# EAGLE design Drehzahlanzeige_RevB (EAGLE 7.6.0)

## Sheet 1 of 2
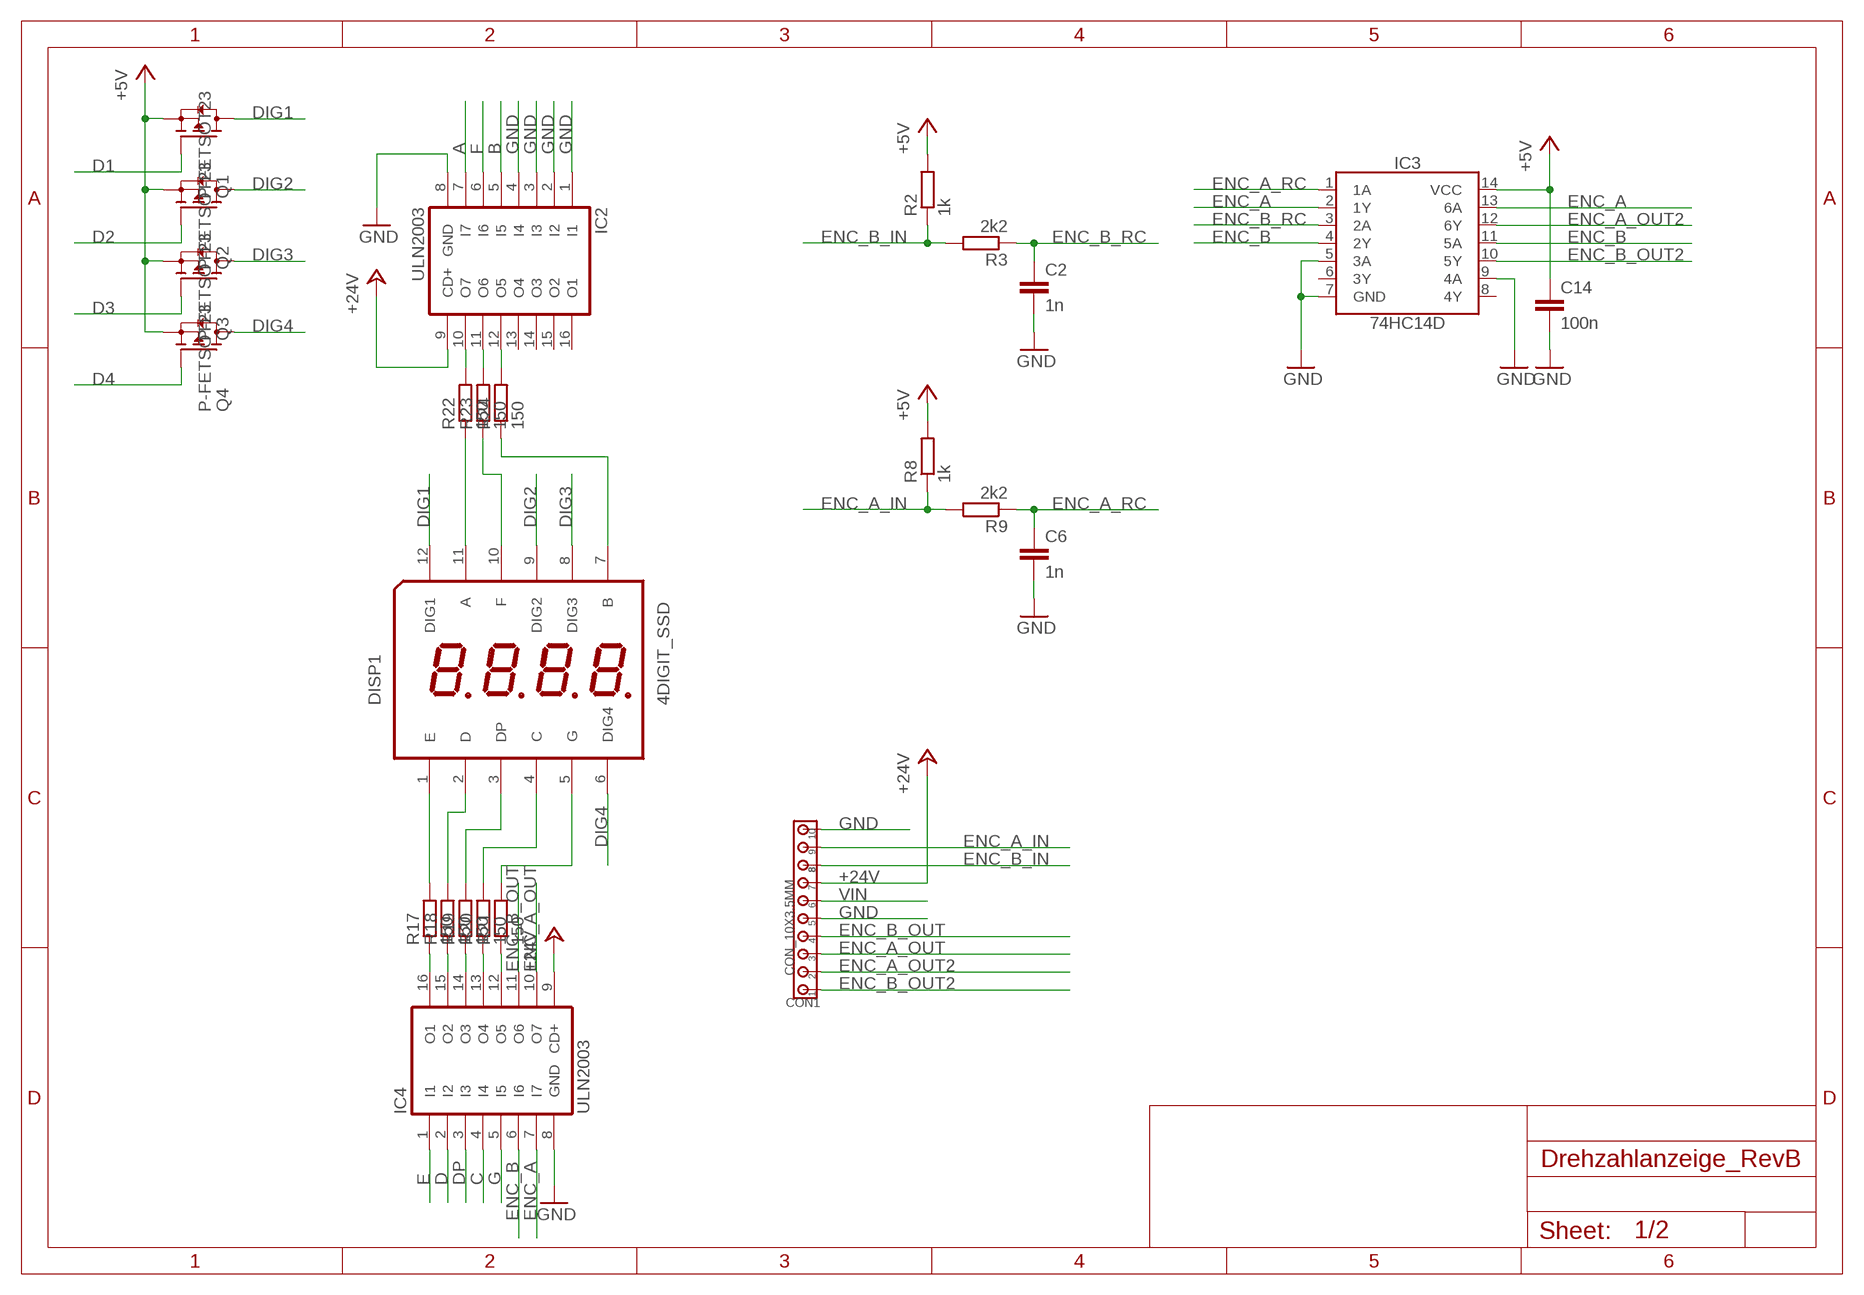
[diagram p0: schematic, sheet 1]

### Parts
C2  1n  CC0805  [C0805]
C6  1n  CC0805  [C0805]
C14  100n  CC0805  [C0805]
CON1  CON_10X3.5MM  [3.5MM_10X]
DISP1  4DIGIT_SSD  [4DIGIT_SSD]
IC2  ULN2003  [SO16]
IC3  74HC14D  [SO14]
IC4  ULN2003  [SO16]
Q1  P-FETSOT23  [SOT23]
Q2  P-FETSOT23  [SOT23]
Q3  P-FETSOT23  [SOT23]
Q4  P-FETSOT23  [SOT23]
R2  1k  RESISTORR0805  [R0805]
R3  2k2  RESISTORR0805  [R0805]
R8  1k  RESISTORR0805  [R0805]
R9  2k2  RESISTORR0805  [R0805]
R17  150  RESISTORR0805  [R0805]
R18  150  RESISTORR0805  [R0805]
R19  150  RESISTORR0805  [R0805]
R20  150  RESISTORR0805  [R0805]
R21  150  RESISTORR0805  [R0805]
R22  150  RESISTORR0805  [R0805]
R23  150  RESISTORR0805  [R0805]
R24  150  RESISTORR0805  [R0805]

### Nets
+5V [+5v]: C14.1 IC3.14(VCC) Q1.2(S) Q2.2(S) Q3.2(S) Q4.2(S) R2.2 R8.2 ; also sheet 2
+24V [+5v]: CON1.7 IC2.9(CD+) IC4.9(CD+) ; also sheet 2
A: IC2.7(I7) ; also sheet 2
B: IC2.5(I5) ; also sheet 2
C: IC4.4(I4) ; also sheet 2
D: IC4.2(I2) ; also sheet 2
D1: Q1.1(G) ; also sheet 2
D2: Q2.1(G) ; also sheet 2
D3: Q3.1(G) ; also sheet 2
D4: Q4.1(G) ; also sheet 2
DIG1: DISP1.12(DIG1) Q1.3(D)
DIG2: DISP1.9(DIG2) Q2.3(D)
DIG3: DISP1.8(DIG3) Q3.3(D)
DIG4: DISP1.6(DIG4) Q4.3(D)
DP: IC4.3(I3) ; also sheet 2
E: IC4.1(I1) ; also sheet 2
ENC_A: IC3.2(1Y) IC3.13(6A) IC4.7(I7) ; also sheet 2
ENC_A_IN: CON1.9 R8.1 R9.2
ENC_A_OUT: CON1.3 IC4.10(O7)
ENC_A_OUT2: CON1.2 IC3.12(6Y)
ENC_A_RC: C6.1 IC3.1(1A) R9.1
ENC_B: IC3.4(2Y) IC3.11(5A) IC4.6(I6) ; also sheet 2
ENC_B_IN: CON1.8 R2.1 R3.2
ENC_B_OUT: CON1.4 IC4.11(O6)
ENC_B_OUT2: CON1.1 IC3.10(5Y)
ENC_B_RC: C2.1 IC3.3(2A) R3.1
F: IC2.6(I6) ; also sheet 2
G: IC4.5(I5) ; also sheet 2
GND: C2.2 C6.2 C14.2 CON1.5 CON1.10 IC2.1(I1) IC2.2(I2) IC2.3(I3) IC2.4(I4) IC2.8(GND) IC3.5(3A) IC3.7(GND) IC3.9(4A) IC4.8(GND) ; also sheet 2
N$5: DISP1.1(E) R17.2
N$6: DISP1.2(D) R18.2
N$10: DISP1.3(DP) R19.2
N$11: DISP1.4(C) R20.2
N$12: DISP1.5(G) R21.2
N$13: DISP1.11(A) R22.1
N$14: DISP1.10(F) R23.1
N$15: DISP1.7(B) R24.1
N$16: IC4.16(O1) R17.1
N$17: IC4.15(O2) R18.1
N$18: IC4.14(O3) R19.1
N$19: IC4.13(O4) R20.1
N$20: IC4.12(O5) R21.1
N$21: IC2.10(O7) R22.2
N$22: IC2.11(O6) R23.2
N$23: IC2.12(O5) R24.2
VIN: CON1.6 ; also sheet 2
Unconnected: IC2.13(O4) IC2.14(O3) IC2.15(O2) IC2.16(O1) IC3.6(3Y) IC3.8(4Y)

## Sheet 2 of 2
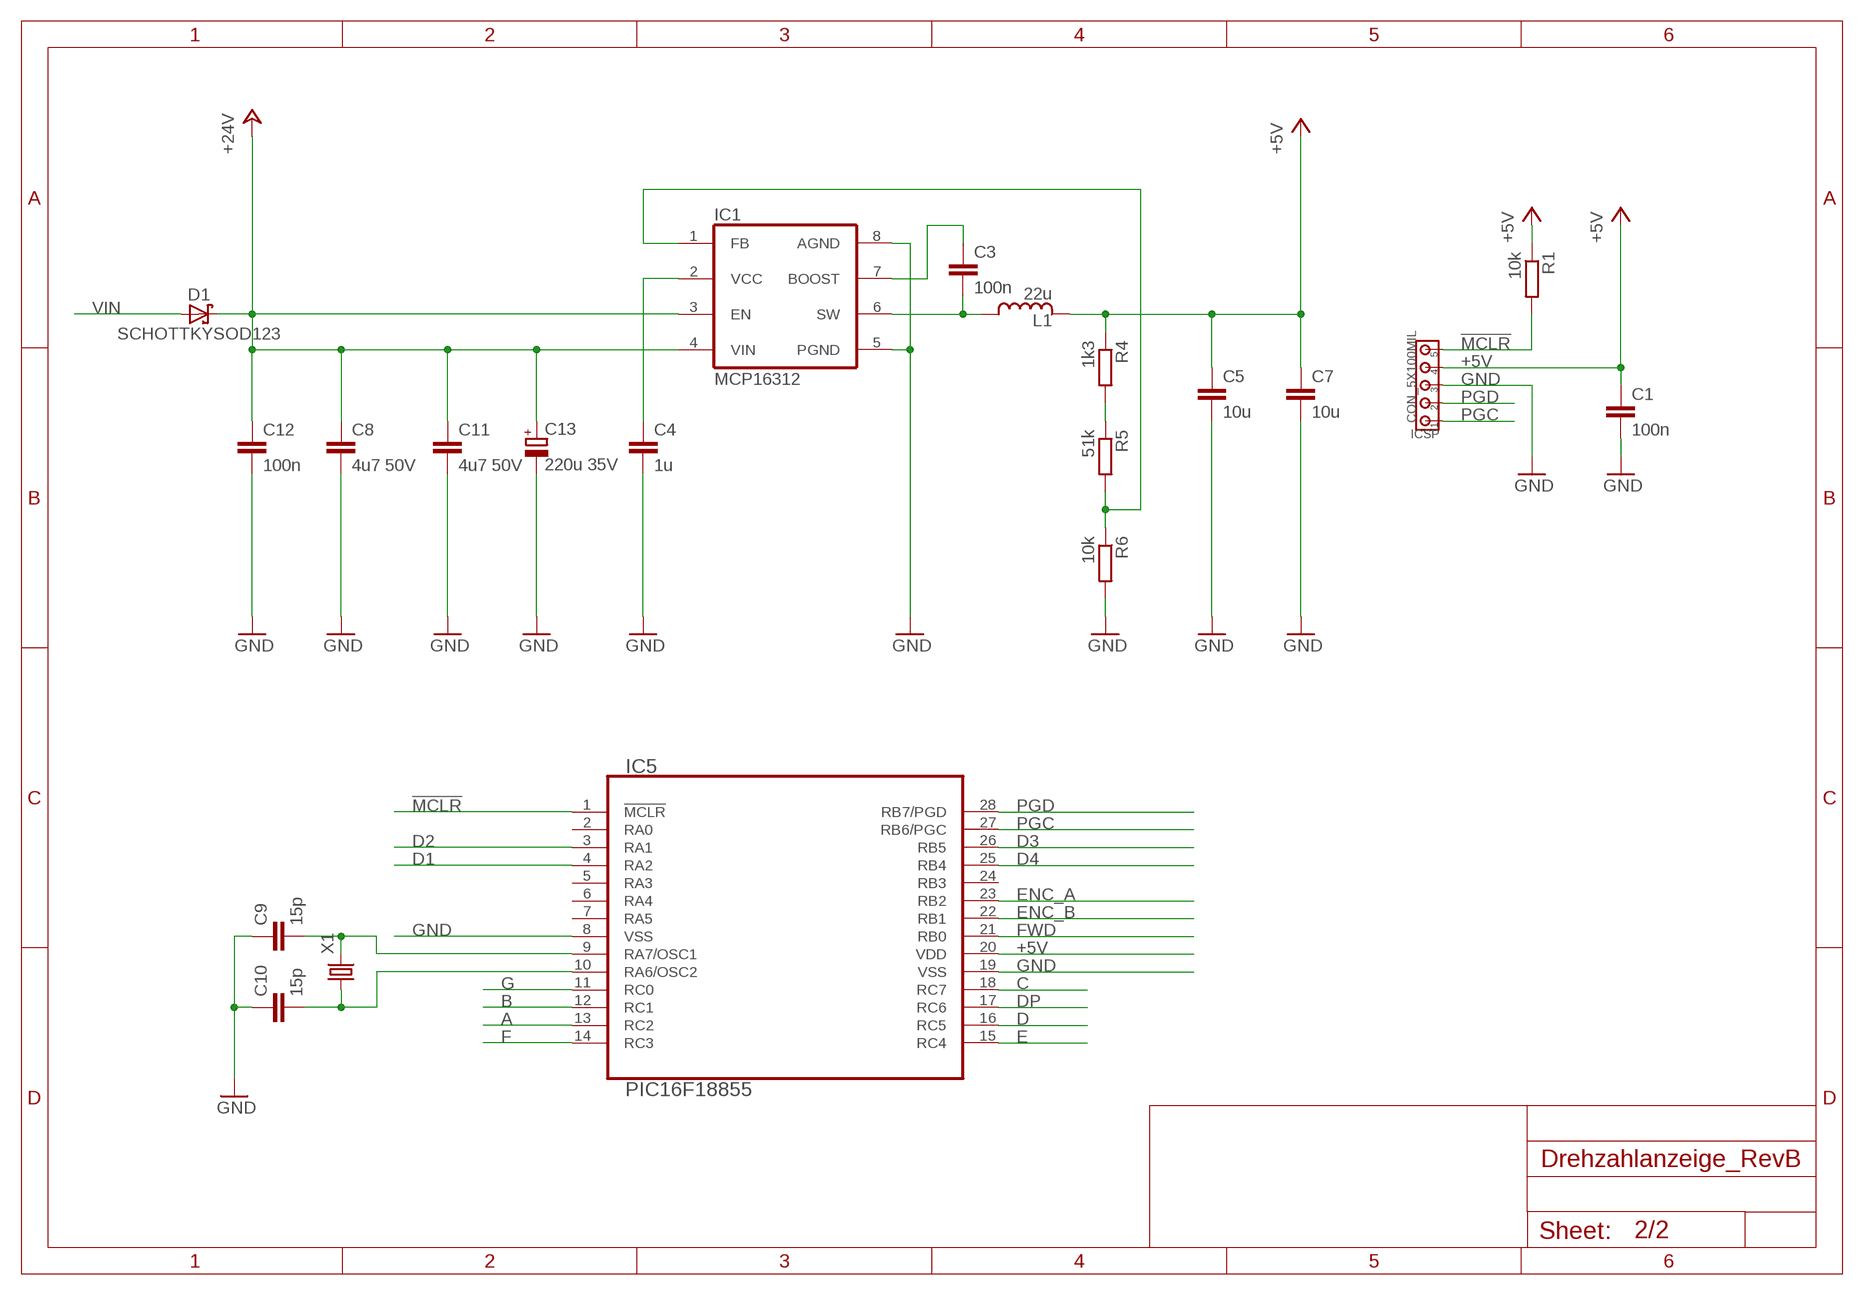
[diagram p1: schematic, sheet 2]

### Parts
C1  100n  CC0805  [C0805]
C3  100n  CC0805  [C0805]
C4  1u  CC0805  [C0805]
C5  10u  CC0805  [C0805]
C7  10u  CC0805  [C0805]
C8  4u7 50V  CC1206  [C1206]
C9  15p  CC0805  [C0805]
C10  15p  CC0805  [C0805]
C11  4u7 50V  CC1206  [C1206]
C12  100n  CC0805  [C0805]
C13  220u 35V  C_POLARIZED8MM  [8MM]
D1  SCHOTTKYSOD123  [SOD123]
IC1  MCP16312  MCP16311  [MSOP8]
IC5  PIC16F18855  [SO28W]
ICSP  CON_5X100MIL  [100MIL_5X]
L1  22u  INDUCTORLPS4018  [LPS4018]
R1  10k  RESISTORR0805  [R0805]
R4  1k3  RESISTORR0805  [R0805]
R5  51k  RESISTORR0805  [R0805]
R6  10k  RESISTORR0805  [R0805]
X1  CRYSTAL5X3.2MM  [5X3.2MM]

### Nets
!MCLR!: IC5.1(!MCLR!) ICSP.5 R1.2
+5V [+5v]: C1.1 C5.1 C7.1 IC5.20(VDD) ICSP.4 L1.2 R1.1 R4.1 ; also sheet 1
+24V [+5v]: C8.1 C11.1 C12.1 C13.+ D1.C IC1.3(EN) IC1.4(VIN) ; also sheet 1
A: IC5.13(RC2) ; also sheet 1
B: IC5.12(RC1) ; also sheet 1
BOOST: C3.1 IC1.7(BOOST)
C: IC5.18(RC7) ; also sheet 1
D: IC5.16(RC5) ; also sheet 1
D1: IC5.4(RA2) ; also sheet 1
D2: IC5.3(RA1) ; also sheet 1
D3: IC5.26(RB5) ; also sheet 1
D4: IC5.25(RB4) ; also sheet 1
DP: IC5.17(RC6) ; also sheet 1
E: IC5.15(RC4) ; also sheet 1
ENC_A: IC5.23(RB2) ; also sheet 1
ENC_B: IC5.22(RB1) ; also sheet 1
F: IC5.14(RC3) ; also sheet 1
FWD: IC5.21(RB0)
G: IC5.11(RC0) ; also sheet 1
GND: C1.2 C4.2 C5.2 C7.2 C8.2 C9.1 C10.1 C11.2 C12.2 C13.- IC1.5(PGND) IC1.8(AGND) IC5.8(VSS) IC5.19(VSS) ICSP.3 R6.2 ; also sheet 1
N$3: IC1.1(FB) R5.2 R6.1
N$4: R4.2 R5.1
N$8: C4.1 IC1.2(VCC)
N$32: C10.2 IC5.10(RA6/OSC2) X1.1
N$33: C9.2 IC5.9(RA7/OSC1) X1.2
PGC: IC5.27(RB6/PGC) ICSP.1
PGD: IC5.28(RB7/PGD) ICSP.2
SWITCH: C3.2 IC1.6(SW) L1.1
VIN: D1.A ; also sheet 1
Unconnected: IC5.2(RA0) IC5.5(RA3) IC5.7(RA5) IC5.24(RB3)

## Power pins joined to a net without a drawn wire
RA4: IC5.6(RA4)

## Library data of the parts
C1-C12 C14 = 00Capacitor:C: Capacitor
C13 = 00Capacitor:C_POLARIZED
CON1 = 00Connector:CON_10X: 10-pin header
D1 = 00Diode:SCHOTTKY
DISP1 = 00Display:4DIGIT_SSD: 4 digit 7-segment display
IC1 = 00VoltageRegulator:MCP16311
IC2 IC4 = 00Transistor:ULN2003: Seven Darlington array
IC3 = 00Logic:74HC14: Hex Inverter Schmitt Trigger
IC5 = 00PIC:PIC16F18855
ICSP = 00Connector:CON_5X: 5-pin header
L1 = 00Inductor:INDUCTOR
Q1-Q4 = 00Mosfet:P-FET
R1-R6 R8 R9 R17-R24 = 00Resistor:RESISTOR: RESISTOR, European symbol
X1 = 00Crystal:CRYSTAL: Crystal

## Net classes
1 mains: width 0.813 mm, drill 0.6 mm, clearance 0.813 mm to class 0, clearance 0.813 mm
2 relay: width 0.813 mm, drill 0.6 mm, clearance 0.61 mm to class 0, clearance 0.61 mm to class 1
3 12v: width 0.61 mm, drill 0.6 mm, clearance 0.406 mm to class 0, clearance 0.406 mm to class 1, clearance 0.406 mm to class 2, clearance 0.406 mm
4 analog: width 0.406 mm, drill 0.6 mm, clearance 0.406 mm to class 0, clearance 0.406 mm to class 1, clearance 0.406 mm to class 2, clearance 0.406 mm to class 3, clearance 0.406 mm
5 +5v: width 0.61 mm, drill 0.6 mm, clearance 0.254 mm to class 0, clearance 0.254 mm to class 1, clearance 0.254 mm to class 2, clearance 0.254 mm to class 3, clearance 0.254 mm to class 4, clearance 0.254 mm

## Board
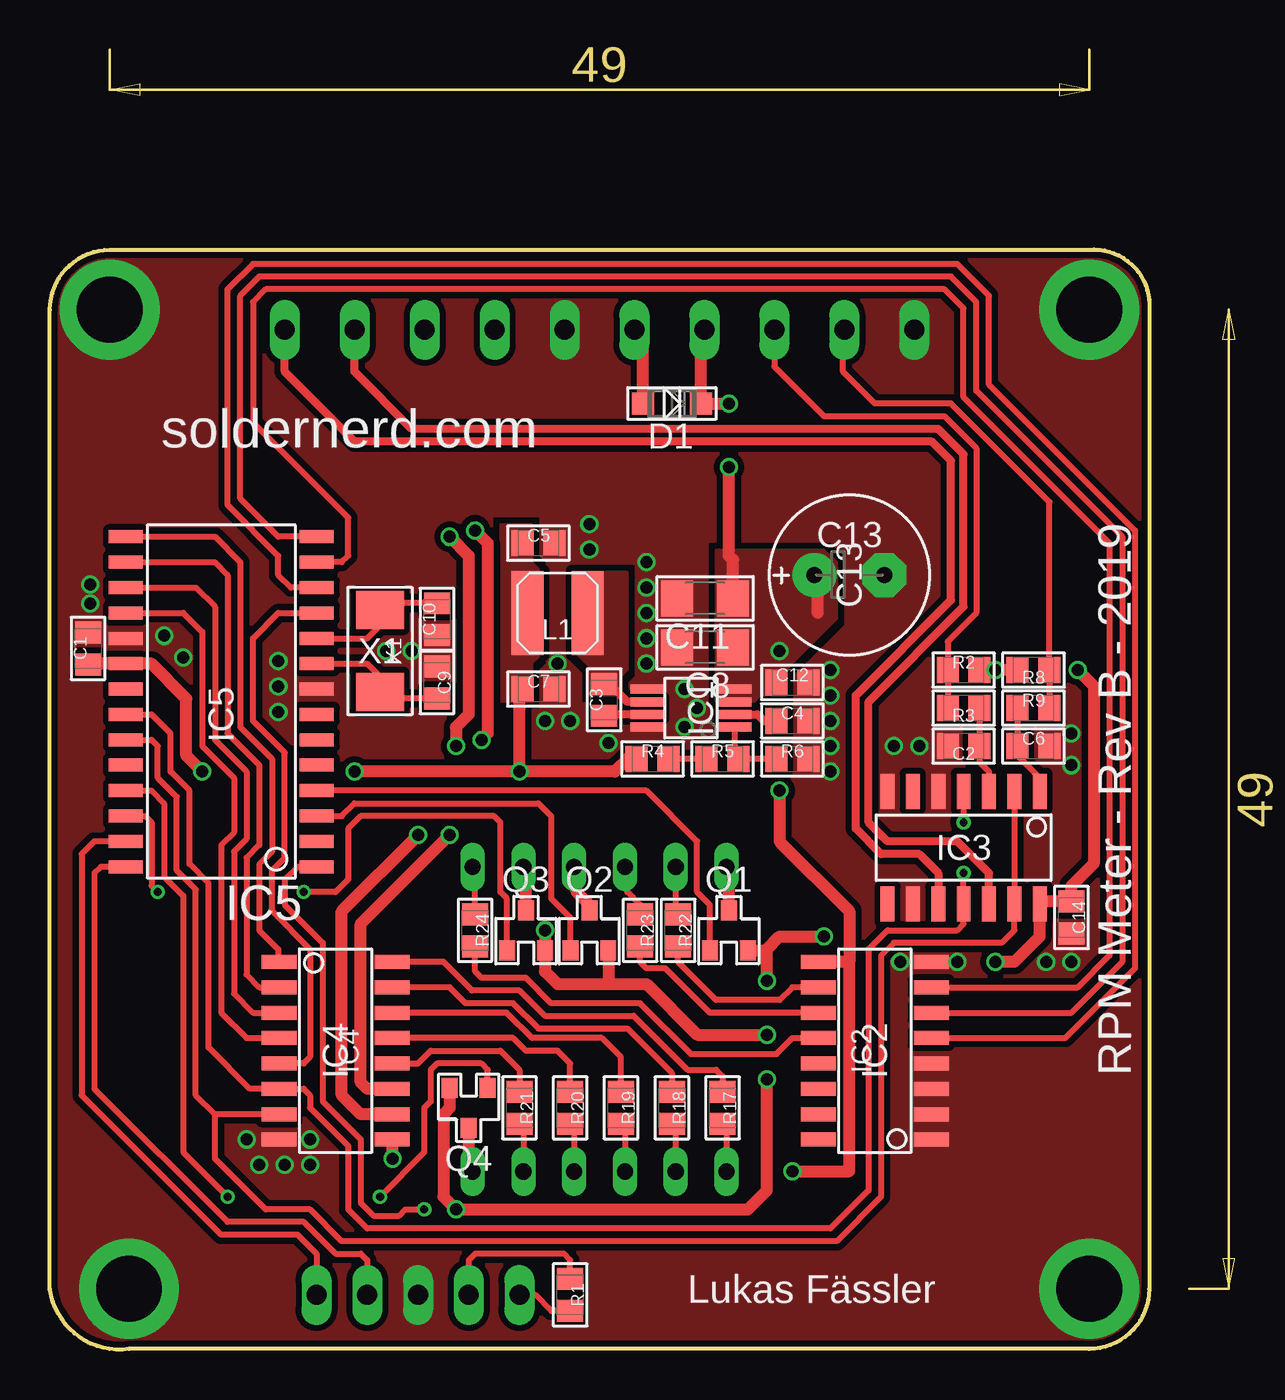
[diagram p2: board, top side]
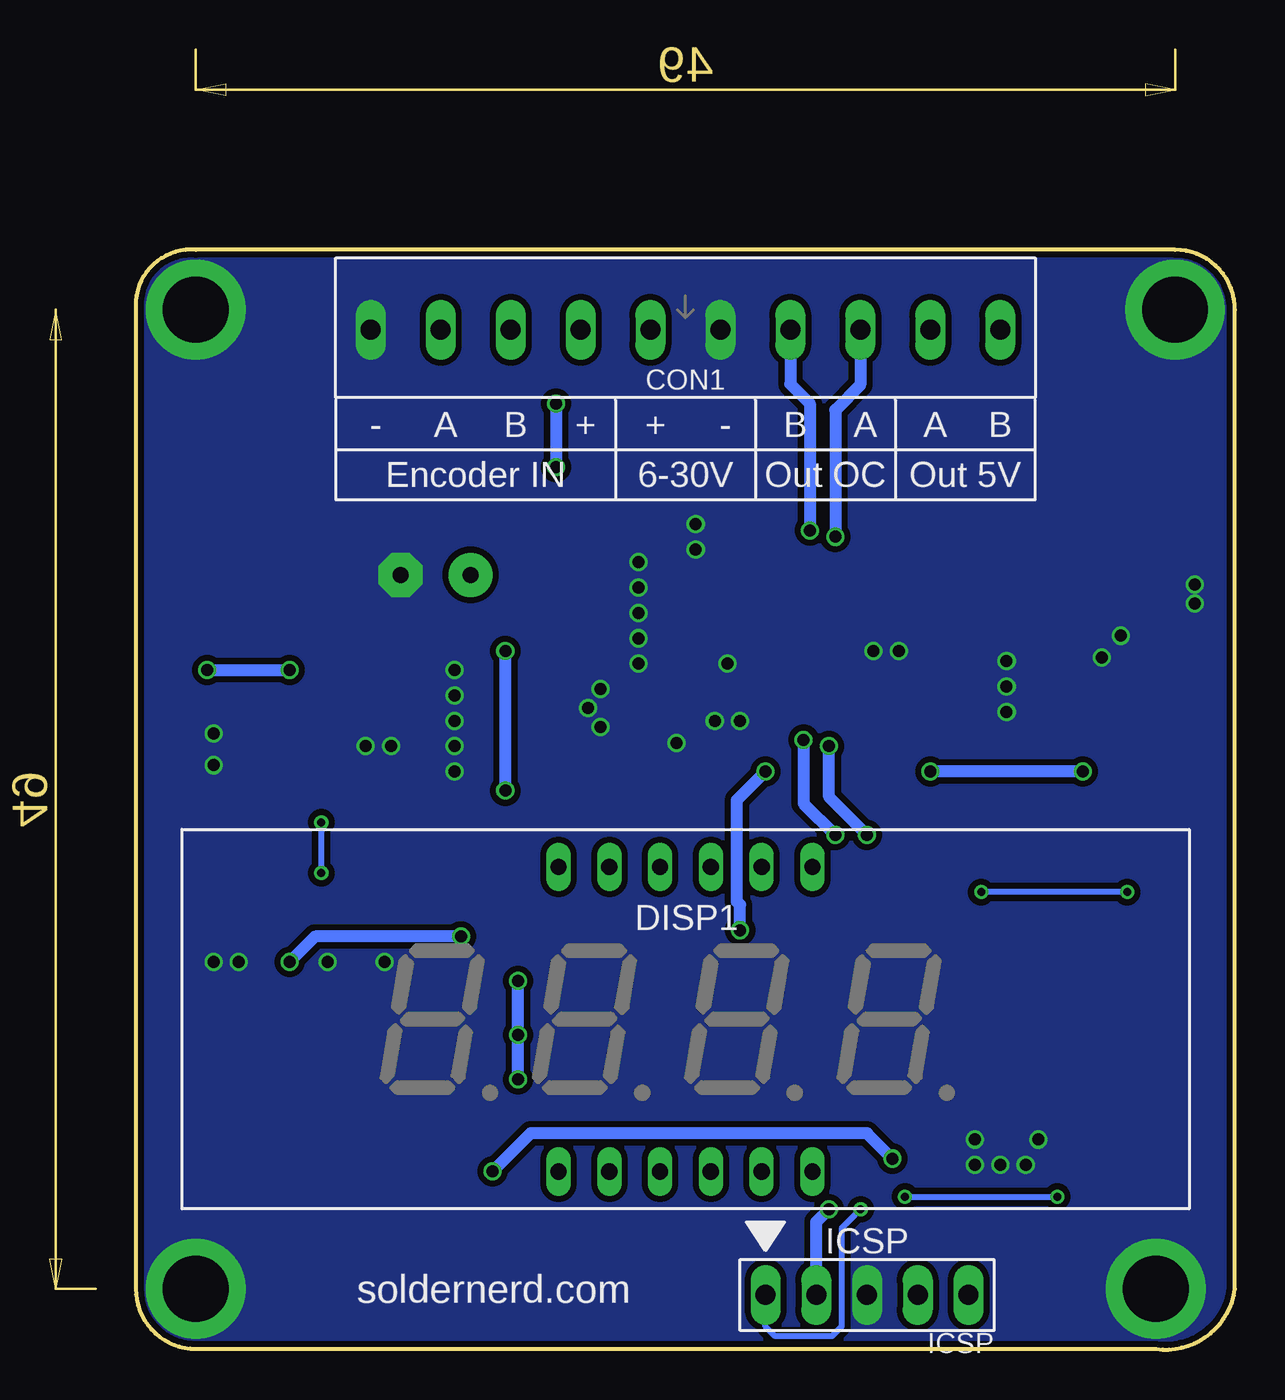
[diagram p3: board, bottom side, seen from below]

Size 55 x 55.04 mm. Coordinates in mm from the lower left corner, seen from the top.
Outline: 0,3.03 0,52.03 arc-90 3,55.03 52,55.03 arc-90 55,52.51 55,3.03 arc-90 52,0.03 3.95,0.03 arc-90 0,3.03
Copper layers (1*16): Top 0.035mm / dielectric 1.5mm / Bottom 0.035mm
Design rules "dirt_cheap_dirty_boards.6mil": minimum track width 6mil, minimum drill 12mil, track to track 6mil, track to pad 6mil, pad to pad 6mil, via to via 6mil, smd to smd 0mil, copper to edge 10mil, drill to drill 10mil, minimum pad ring 8mil, minimum via ring 6mil, stop-mask expansion 2mil, vias tented up to drill 25mil, thermal gap 10mil

### Footprints (pad centres in the part's own frame; a part is rotated, then mirrored left to right if it is on the bottom)
C0805 = smd 1.1 x 1.3: 1 -0.8,0; 2 0.8,0
C1206 = smd 1.6 x 1.8: 1 -1.4,0; 2 1.4,0
8MM = drill 0.8 pad 2.2: + -1.75,0 | drill 0.8 pad 2.2 octagon: - 1.75,0
3.5MM_10X = drill 1 long: 1 -15.75,0; 2 -12.25,0; 3 -8.75,0; 4 -5.25,0; 5 -1.75,0; 6 1.75,0; 7 5.25,0; 8 8.75,0; 9 12.25,0; 10 15.75,0
SOD123 = smd 1.1 x 1.1: A 1.45,0; C -1.45,0
4DIGIT_SSD = drill 0.813 long: 1 -6.35,-7.62; 2 -3.81,-7.62; 3 -1.27,-7.62; 4 1.27,-7.62; 5 3.81,-7.62; 6 6.35,-7.62; 7 6.35,7.62; 8 3.81,7.62; 9 1.27,7.62; 10 -1.27,7.62; 11 -3.81,7.62; 12 -6.35,7.62
MSOP8 = smd 1.65 x 0.45: 1 -2.2,0.953; 2 -2.2,0.318; 3 -2.2,-0.318; 4 -2.2,-0.953; 5 2.2,-0.953; 6 2.2,-0.318; 7 2.2,0.318; 8 2.2,0.953
SO16 = smd 0.7 x 1.75: 1 -4.445,-2.825; 2 -3.175,-2.825; 3 -1.905,-2.825; 4 -0.635,-2.825; 5 0.635,-2.825; 6 1.905,-2.825; 7 3.175,-2.825; 8 4.445,-2.825; 9 4.445,2.825; 10 3.175,2.825; 11 1.905,2.825; 12 0.635,2.825; 13 -0.635,2.825; 14 -1.905,2.825; 15 -3.175,2.825; 16 -4.445,2.825
SO14 = smd 0.7 x 1.75: 1 -3.81,-2.825; 2 -2.54,-2.825; 3 -1.27,-2.825; 4 0,-2.825; 5 1.27,-2.825; 6 2.54,-2.825; 7 3.81,-2.825; 8 3.81,2.825; 9 2.54,2.825; 10 1.27,2.825; 11 0,2.825; 12 -1.27,2.825; 13 -2.54,2.825; 14 -3.81,2.825
SO28W = smd 0.65 x 1.7: 1 -7.62,-4.78; 2 -6.35,-4.78; 3 -5.08,-4.78; 4 -3.81,-4.78; 5 -2.54,-4.78; 6 -1.27,-4.78; 7 0,-4.78; 8 1.27,-4.78; 9 2.54,-4.78; 10 3.81,-4.78; 11 5.08,-4.78; 12 6.35,-4.78; 13 7.62,-4.78; 14 8.89,-4.78; 15 8.89,4.78; 16 7.62,4.78; 17 6.35,4.78; 18 5.08,4.78; 19 3.81,4.78; 20 2.54,4.78; 21 1.27,4.78; 22 0,4.78; 23 -1.27,4.78; 24 -2.54,4.78; 25 -3.81,4.78; 26 -5.08,4.78; 27 -6.35,4.78; 28 -7.62,4.78
100MIL_5X = drill 1 long: 1 -5.08,0; 2 -2.54,0; 3 0,0; 4 2.54,0; 5 5.08,0
LPS4018 = smd 1.6 x 4.2: 1 -1.5,0; 2 1.5,0
SOT23 = smd 0.8 x 1: 1 -0.95,-1; 2 0.95,-1; 3 0,1
R0805 = smd 1.1 x 1.3: 1 -0.8,0; 2 0.8,0
5X3.2MM = smd 1.9 x 2.4: 1 -2.05,0; 2 2.05,0

### Placement (x,y rotation side)
C1  1.91,35.08 90 top
C2  45.72,30.19 180 top
C3  27.73,32.51 90 top
C4  37.15,31.46 0 top
C5  24.45,40.35 0 top
C6  49.21,30.19 0 top
C7  24.45,33.05 0 top
C8  32.78,35.13 180 top
C9  19.37,33.37 270 top
C10  19.37,36.54 90 top
C11  32.78,37.59 180 top
C12  37.15,33.37 0 top
C13  40.01,38.76 0 top
C14  51.12,21.62 270 top
CON1  27.5,51.03 180 bottom
D1  31.11,47.34 180 top
DISP1  27.5,16.53 0 bottom
IC1  32.07,32.1 180 top
IC2  41.27,14.95 90 top
IC3  45.72,25.11 180 top
IC4  14.29,14.95 270 top
IC5  8.57,31.78 90 top
ICSP  18.41,2.73 180 bottom
L1  25.4,36.86 180 top
Q1  33.97,20.98 0 top
Q2  26.99,20.98 0 top
Q3  23.81,20.98 0 top
Q4  20.95,12.09 180 top
R1  26.04,2.73 270 top
R2  45.72,34 0 top
R3  45.72,32.1 180 top
R4  30.16,29.56 0 top
R5  33.66,29.56 0 top
R6  37.15,29.56 0 top
R8  49.21,34 180 top
R9  49.21,32.1 0 top
R17  33.66,12.09 270 top
R18  31.11,12.09 270 top
R19  28.57,12.09 270 top
R20  26.04,12.09 270 top
R21  23.5,12.09 270 top
R22  31.43,20.98 270 top
R23  29.53,20.98 270 top
R24  21.27,20.98 270 top
X1  16.51,34.95 270 top

### Tracks (layer width: path | path; a pad name or v marks a point on that pad's centre or on a via)
!MCLR!  (via drill 0.4)
  Top 0.305: IC5.1 12.38,24.16 11.75,23.52 11.75,22.25 13.65,20.35 13.65,12.41 15.56,10.51 15.56,7.33 16.19,6.7 17.46,6.7 17.78,7.01 v18.73,7.01 | R1.2 25.08,1.93 24.29,2.73 ICSP.5
  Bottom 0.305: v18.73,7.01 19.68,6.06 19.68,1.14 20.16,0.66 23.02,0.66 23.5,1.14 ICSP.5
+5V  (via drill 0.6)
  Top 0.305: R1.1 26.04,4.47 25.72,4.79 21.27,4.79 20.95,4.47 ICSP.4
  Top 0.61: 27.94,18.29 25.4,18.29 24.77,18.92 24.76,18.92 Q3.2 v24.76,20.98 v24.77,20.98 | 27.94,18.29 29.84,18.29 32.38,15.75 v35.88,15.75 | v23.5,28.92 v15.24,28.92 | v51.44,34 52.23,33.21 52.23,24.32 51.12,23.21 C14.1 49.66,22.42 IC3.14 49.53,20.67 48.26,19.4 v47.31,19.4 | R8.2 v47.31,34 R2.2 | Q2.2 27.94,18.29 | Q4.2 20,12.09 19.68,11.78 19.68,7.65 v20.32,7.01 34.92,7.01 35.88,7.97 v35.88,13.52 | v35.88,18.44 35.88,20.03 | 35.88,20.03 36.51,20.67 v38.73,20.67 | Q1.2 35.83,19.98 35.88,20.03 | C1.1 1.91,34.32 IC5.20 5.08,34.32 6.83,32.57 6.83,29.72 v7.62,28.92 | v23.5,28.92 28.26,28.92 28.89,29.56 R4.1 | v23.5,28.92 23.5,32.9 C7.1
  Bottom 0.61: v35.88,13.52 v35.88,15.75 v35.88,18.44 | v7.62,28.92 v15.24,28.92 | v51.44,34 v47.31,34 | v24.77,20.98 24.77,22.25 24.92,22.41 24.92,27.49 v23.5,28.92 | v38.73,20.67 46.04,20.67 v47.31,19.4 | ICSP.4 20.95,6.38 v20.32,7.01
  pour Top (isolate 0.305, no thermals): 24.13,41.3 24.13,39.4 24.45,39.08 24.45,34.64 24.13,34.32 24.13,32.41 22.54,32.41 22.54,41.3
+24V  (via drill 0.6)
  Top 0.61: 38.42,36.86 38.42,38.6 C13.+ | v37.15,8.92 40.01,8.92 40.01,19.4 | 40.01,19.4 IC2.9 | CON1.7 32.56,50.84 D1.C v33.97,47.34 | C11.1 34.18,39.51 33.97,39.72 v33.97,44.16 | v36.51,27.97 36.51,25.43 40.01,21.94 40.01,19.4 | IC4.9 17.11,9.59 v17.14,9.55
  Bottom 0.61: v33.97,47.34 v33.97,44.16 | v36.51,27.97 v36.51,34.95 | v17.14,9.55 18.41,10.82 35.24,10.82 v37.15,8.92
  pour Top (isolate 0.305, no thermals): 36.83,32.73 35.56,32.73 35.24,32.41 33.34,32.41 33.34,40.03 38.73,40.03 39.37,39.4 39.37,36.54 36.83,34
A
  Top 0.305: IC2.7 51.44,18.13 53.02,19.71 53.02,40.35 45.72,47.65 45.72,52.1 44.77,53.05 10.79,53.05 10.16,52.42 10.16,46.38 14.92,41.62 14.92,39.72 14.61,39.4 IC5.13
B
  Top 0.305: IC2.5 50.8,15.59 54.29,19.08 54.29,40.99 46.99,48.29 46.99,52.73 45.4,54.32 10.16,54.32 8.89,53.05 8.89,42.26 11.43,39.72 11.43,38.76 12.06,38.13 IC5.12
BOOST
  Top 0.406: IC1.7 27.8,31.78 C3.1
C
  Top 0.305: IC5.18 6.67,36.86 7.62,35.91 7.62,30.19 9.21,28.6 9.21,25.87 8.57,25.24 8.57,16.86 9.84,15.59 IC4.4
D
  Top 0.305: IC5.16 8.26,39.4 8.89,38.76 8.89,30.83 10.48,29.24 10.48,25.24 9.84,24.6 9.84,18.76 10.48,18.13 IC4.2
D1
  Top 0.305: Q1.1 33.02,22.25 32.38,22.89 32.38,25.43 29.84,27.97 IC5.4
D2
  Top 0.305: IC5.3 14.61,26.7 15.24,27.33 24.45,27.33 25.08,26.7 25.08,22.57 26.04,21.62 Q2.1
D3  (via drill 0.4)
  Top 0.305: IC5.26 4.76,26.7 5.08,26.38 5.08,23.21 v5.4,22.89 | Q3.1 22.86,22.57 22.54,22.89 22.54,26.38 22.23,26.7 15.56,26.7 14.92,26.06 14.92,23.52 14.29,22.89 v12.7,22.89
  Bottom 0.305: v5.4,22.89 v12.7,22.89
D4  (via drill 0.4)
  Top 0.305: IC5.25 5.08,27.97 5.71,27.33 5.71,23.65 6.67,22.7 6.67,9.87 v8.89,7.65 | Q4.1 21.91,14 21.59,14.32 19.37,14.32 19.05,14 19.05,12.41 18.73,12.09 18.73,9.87 v16.51,7.65
  Bottom 0.305: v16.51,7.65 v8.89,7.65
DIG1
  Top 0.61: Q1.3 33.97,24.03 DISP1.12
DIG2
  Top 0.61: Q2.3 26.99,22.25 26.35,22.89 26.35,24.03 DISP1.9
DIG3
  Top 0.406: Q3.3 23.77,21.98
  Top 0.61: Q3.3 23.81,24.03 DISP1.8
DIG4
  Top 0.61: 20.95,11.14 Q4.3 20.95,9.1 DISP1.6
DP
  Top 0.305: IC5.17 7.3,38.13 8.26,37.18 8.26,30.51 9.84,28.92 9.84,25.56 9.21,24.92 9.21,17.81 10.16,16.86 IC4.3
E
  Top 0.305: IC5.15 8.26,40.67 9.53,39.4 9.53,31.14 11.11,29.56 11.11,24.92 10.48,24.29 10.48,20.98 11.43,20.03 11.43,19.43 IC4.1
ENC_A
  Top 0.305: IC5.23 5.08,30.51 5.4,30.19 5.4,28.6 6.35,27.65 6.35,23.97 7.3,23.02 7.3,12.73 8.26,11.78 | IC3.2 IC3.13 48.26,20.98 47.62,20.35 42.23,20.35 41.59,19.71 41.59,7.65 39.37,5.43 14.61,5.43 13.02,7.01 10.79,7.01 8.26,9.55 8.26,11.78 | IC4.7 8.26,11.78
ENC_A_IN
  Top 0.305: R9.2 R8.1 50.01,42.41 45.09,47.34 41.27,47.34 39.69,48.92 39.69,50.97 CON1.9
ENC_A_OUT  (via drill 0.6)
  Top 0.61: v20,40.67 20.95,39.72 20.95,31.78 20.32,31.14 v20.32,30.19 | IC4.10 15.56,11.78 14.61,12.73 14.61,21.94 v18.41,25.75
  Bottom 0.61: CON1.3 18.75,48.27 20,47.02 v20,40.67 | v18.41,25.75 20.32,27.65 v20.32,30.19
ENC_A_OUT2
  Top 0.406: IC3.12 46.99,23.84 45.4,25.43 41.91,25.43 40.96,26.38 40.96,32.41 45.72,37.18 45.72,44.8 44.45,46.07 18.1,46.07 15.24,48.92 CON1.2
ENC_A_RC
  Top 0.305: R9.1 C6.1 48.41,29.72 49.53,28.6 IC3.1
ENC_B  (via drill 0.4)
  Top 0.305: IC5.22 5.08,31.78 6.03,30.83 6.03,28.92 6.99,27.97 6.99,24.29 7.94,23.33 7.94,15.11 10,13.05 IC4.6 12.7,13.05 13.02,12.73 13.02,12.09 14.92,10.19 14.92,7.01 15.88,6.06 39.05,6.06 40.96,7.97 40.96,20.03 41.91,20.98 45.4,20.98 45.72,21.3 IC3.11 v45.72,23.84 | IC3.4 v45.72,26.38
  Bottom 0.305: v45.72,26.38 v45.72,23.84
ENC_B_IN
  Top 0.305: R3.2 R2.1 44.92,35.42 46.35,36.86 46.35,45.11 44.77,46.7 38.73,46.7 36.25,49.19 CON1.8
ENC_B_OUT  (via drill 0.6)
  Top 0.61: IC4.11 15.88,13.05 15.56,13.36 15.56,21.3 v20,25.75 | v21.27,40.99 21.91,40.35 21.91,30.83 v21.59,30.51
  Bottom 0.61: CON1.4 22.25,48.31 21.27,47.34 v21.27,40.99 | v21.59,30.51 21.59,27.33 v20,25.75
ENC_B_OUT2
  Top 0.406: CON1.1 11.75,48.92 15.24,45.43 44.13,45.43 45.09,44.48 45.09,37.49 40.32,32.73 40.32,26.06 41.59,24.79 43.5,24.79 44.45,23.84 IC3.10
ENC_B_RC
  Top 0.305: R3.1 C2.1 46.52,29.39 46.99,28.92 IC3.3
F
  Top 0.305: IC2.6 51.12,16.86 53.66,19.4 53.66,40.67 46.35,47.97 46.35,52.42 45.09,53.69 10.48,53.69 9.53,52.73 9.53,42.57 11.43,40.67 IC5.14
G
  Top 0.305: IC5.11 11.43,36.86 10.16,35.59 10.16,31.46 11.75,29.87 11.75,24.6 11.11,23.97 11.11,21.94 13.02,20.03 13.02,14.63 12.7,14.32 IC4.5
GND  (via drill 0.6, 3.3 pad 5)
  other vias: 16.83,34.95 18.1,34.95 2.02,37.32 2.02,38.27 9.84,10.51 3,52.03 52,52.03 52,3.03 3.95,3.03 31.75,31.14 32.38,32.1 31.75,33.05 29.84,34.32 29.84,35.59 29.84,36.86 29.84,38.13 39.05,34 39.05,32.73 39.05,31.46 39.05,30.19 39.05,28.92 10.48,9.24 11.75,9.24 5.71,35.72 6.67,34.64 11.43,34.45 11.43,33.18 11.43,31.91 24.77,31.46 25.4,34.32 29.84,39.4 26.99,40.03 26.99,41.3 26.04,31.46 27.94,30.35 51.12,19.4 43.5,30.19 42.23,30.19 51.12,30.83 51.12,29.24 42.55,19.4 45.4,19.4 49.85,19.4 13.02,10.51 13.02,9.24
  pour Bottom (isolate 0.305, rank 2, no thermals): 0,52.03 0,3.03 arc90 3.95,0.03 52,0.03 arc90 55,3.03 55,52.51 arc90 52,55.03 3,55.03 arc90
  pour Top (isolate 0.305, rank 2, no thermals): 0,52.03 0,3.03 arc90 3.95,0.03 52,0.03 arc90 55,3.03 55,52.51 arc90 52,55.03 3,55.03 arc90
N$3
  Top 0.305: R6.1 R5.2 34.27,29.56 | 34.27,29.43 34.27,29.56 | 34.27,29.56 IC1.1
N$4
  Top 0.305: R5.1 R4.2
N$5
  Top 0.305: R17.2 33.85,11.1 DISP1.1
N$6
  Top 0.305: R18.2 31.31,11.1 DISP1.2
N$8
  Top 0.406: IC1.2 35.4,31.78 35.72,31.46 C4.1
N$10
  Top 0.305: R19.2 28.77,11.1 DISP1.3
N$11
  Top 0.305: R20.2 26.23,11.1 DISP1.4
N$12
  Top 0.305: R21.2 23.69,11.1 DISP1.5
N$13
  Top 0.305: DISP1.11 31.31,21.91 R22.1
N$14
  Top 0.305: R23.1 29.53,22.25 28.89,22.89 28.89,24.03 DISP1.10
N$15
  Top 0.305: R24.1 21.27,24.03 DISP1.7
  Top 0.406: R24.1 21.23,21.78
N$16
  Top 0.305: R17.1 33.66,13.68 33.34,14 31.91,14 29.21,16.7 24.77,16.7 23.5,17.97 21.11,17.97 19.68,19.4 IC4.16
N$17
  Top 0.305: R18.1 31.11,13.84 28.89,16.06 24.45,16.06 23.18,17.33 20.8,17.33 20,18.13 IC4.15
N$18
  Top 0.305: R19.1 28.57,14.63 27.62,15.59 24.13,15.59 22.86,16.86 IC4.14
N$19
  Top 0.305: R20.1 26.04,14.32 25.4,14.95 23.81,14.95 23.18,15.59 IC4.13
N$20
  Top 0.305: IC4.12 18.41,14.32 19.05,14.95 22.54,14.95 23.5,14 R21.1
N$21
  Top 0.305: IC2.10 37.15,18.13 36.51,17.49 33.34,17.49 31.43,19.4 R22.2
N$22
  Top 0.305: IC2.11 33.02,16.86 30.8,19.08 29.84,19.08 29.53,19.4 R23.2
N$23
  Top 0.305: R24.2 21.27,18.92 21.59,18.6 23.81,18.6 25.08,17.33 29.53,17.33 32.07,14.79 36.35,14.79 37.15,15.59 IC2.12
N$32
  Top 0.305: IC5.10 15.88,35.59 16.51,36.22 X1.1 16.85,37.34 C10.2
N$33
  Top 0.305: IC5.9 15.88,34.32 16.51,33.68 X1.2 16.85,32.57 C9.2
PGC
  Top 0.305: IC5.27 2.22,25.43 1.59,24.79 1.59,12.73 8.57,5.74 12.38,5.74 13.34,4.79 ICSP.1
PGD
  Top 0.305: IC5.28 2.54,24.16 2.22,23.84 2.22,13.05 8.89,6.38 12.7,6.38 14.29,4.79 15.56,4.79 15.88,4.47 ICSP.2
SWITCH
  Top 0.406: IC1.6 28.89,32.41 28.26,33.05
  pour Top (isolate 0.305, no thermals): 26.99,32.73 26.99,34.16 26.35,34.8 26.35,38.92 28.89,38.92 28.89,34 28.57,33.68 28.57,32.73
VIN
  Top 0.61: D1.A 29.66,50.61 CON1.6

### Text on the board
tPlace: soldernerd.com | RPM Meter - Rev B - 2019 | Lukas Fässler
bPlace: B | A | A | B | - | + | + | B | A | - | Out 5V | Out OC | 6-30V | Encoder IN | ICSP | soldernerd.com